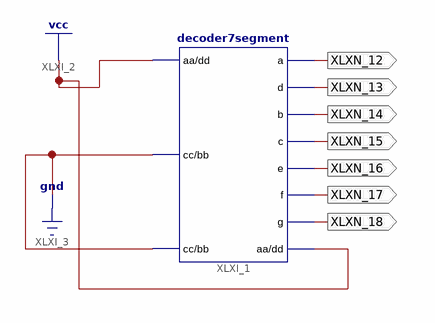
[diagram p0: schematic sheet 1]
// Xilinx ISE schematic test7Segment.sch (spartan6) as structural Verilog: 1 symbols, 7 ports
module test7Segment (
  output XLXN_12,
  output XLXN_13,
  output XLXN_14,
  output XLXN_15,
  output XLXN_16,
  output XLXN_17,
  output XLXN_18
);

  decoder7segment XLXI_1 (
    .aa(1'b1), .cc(1'b0), .bb(1'b0), .a(XLXN_12), .d(XLXN_13), .b(XLXN_14), .c(XLXN_15), .e(XLXN_16),
    .f(XLXN_17), .g(XLXN_18), .dd(1'b1));
endmodule
